# Altium schematic sheet HF.SchDoc: {Наименование}
size 420 x 297 mm; ApprovedBy: {Утвердил}; CheckedBy: {Проверил}; DrawnBy: {Разраб.}; DocumentNumber: АБВГ 123456.789 00; SheetNumber: {}; SheetTotal: {}; Scale: {Мш.}; PageSetup: Record=PageOptions|CenterHorizontal=False|CenterVertical=False|PrintScale=0.95|XCorrection=0.00|YCorrection=0.00|PrintKind=1|BorderSize=5000000|LeftOffset=0|BottomOffset=0|Orientation=1|PaperLength=1000|PaperWidth=1000|Scale=100|PaperSource=15|PrintQuality=600|MediaType=1|DitherType=10|PaperKind=A4|PrintScaleMode=1; ProcessInspection: {Т.контр.}; Mass: {М.}; NormInspection: {Н.контр.}; Letter1Column: {}; Letter2Column: {}; Letter3Column: {}; DocumentType: {Документ}; Rule: PcbType=ProtelPcb
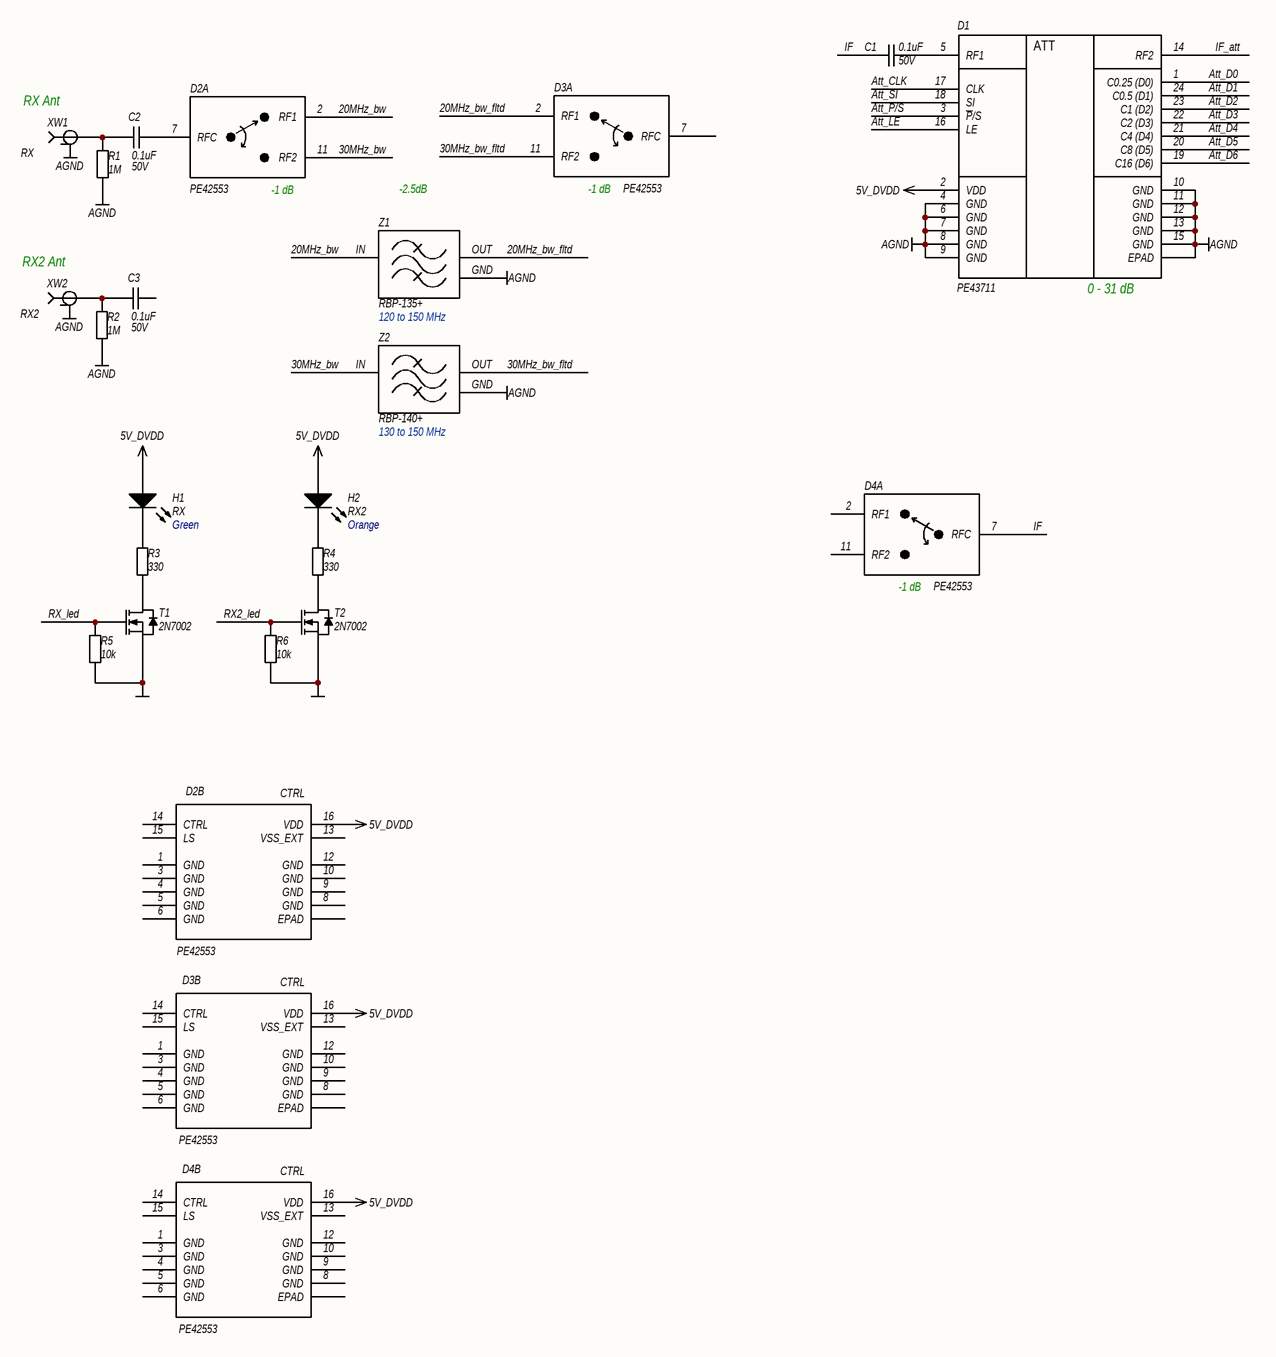
[diagram p0: HF.SchDoc]

## Parts
C1  value 0.1uF  Voltage: 50V  [C0402]  (hidden comment: CAP)
C2  value 0.1uF  Voltage: 50V  [C0402]  (hidden comment: CAP)
C3  value 0.1uF  Voltage: 50V  [C0402]  (hidden comment: CAP)
D1  PE43711  [QFN-24]
D2  PE42553  [QFN-16]  (parts A,B of 2)
D3  PE42553  [QFN-16]  (parts A,B of 2)
D4  PE42553  [QFN-16]  (parts A,B of 2)
H1  RX  Color: Green  [LED]
H2  RX2  Color: Orange  [LED]
R1  value 1M  [R0402]  (hidden comment: RES)
R2  value 1M  [R0402]  (hidden comment: RES)
R3  value 330  [R0805]  (hidden comment: RES)
R4  value 330  [R0805]  (hidden comment: RES)
R5  value 10k  [R0402]  (hidden comment: RES)
R6  value 10k  [R0402]  (hidden comment: RES)
T1  2N7002  [SOT-23]
T2  2N7002  [SOT-23]
XW1  RX  [MOLEX SD-73251-135 (Gold)]
XW2  RX2  [MOLEX SD-73251-135 (Gold)]
Z1  RBP-135+  Frequency: 120 to 150 MHz  [GP731]
Z2  RBP-140+  Frequency: 130 to 150 MHz  [GP731]

## Nets
5V_DVDD: D1.2(VDD) D2.16(VDD) D3.16(VDD) D4.16(VDD) H1.2(A) H2.2(A)
AGND: D1.4(GND) D1.6(GND) D1.7(GND) D1.8(GND) D1.9(GND) D1.10(GND) D1.11(GND) D1.12(GND) D1.13(GND) D1.15(GND) D1.25(EPAD) R1.2 R2.2 XW1.G(GND) XW2.G(GND) Z1.GND Z2.GND
GND: R5.2 R6.2 T1.2(S) T2.2(S)
20MHz_bw: D2.2(RF1) Z1.IN
20MHz_bw_fltd: D3.2(RF1) Z1.OUT
30MHz_bw: D2.11(RF2) Z2.IN
30MHz_bw_fltd: D3.11(RF2) Z2.OUT
Att_CLK: D1.17(CLK)
Att_D0: D1.1(C0.25_(D0))
Att_D1: D1.24(C0.5_(D1))
Att_D2: D1.23(C1_(D2))
Att_D3: D1.22(C2_(D3))
Att_D4: D1.21(C4_(D4))
Att_D5: D1.20(C8_(D5))
Att_D6: D1.19(C16_(D6))
Att_LE: D1.16(LE)
Att_P/~{S}: D1.3(~{P}/S)
Att_SI: D1.18(SI)
IF: C1.1 D4.7(RFC)
IF_att: D1.14(RF2)
RX2_led: R6.1 T2.1(G)
RX_led: R5.1 T1.1(G)
NetC1_2: C1.2 D1.5(RF1)
NetC2_1: C2.1 R1.1 XW1.S(RF)
NetC2_2: C2.2 D2.7(RFC)
NetC3_1: C3.1 R2.1 XW2.S(RF)
NetH1_1: H1.1(K) R3.1
NetH2_1: H2.1(K) R4.1
NetR3_2: R3.2 T1.3(D)
NetR4_2: R4.2 T2.3(D)

Not connected (* = marked no-connect by the designer): C3 2; D2 1(GND) 3(GND) 4(GND) 5(GND) 6(GND) 8(GND) 9(GND) 10(GND) 12(GND) 13(VSS_EXT) 14(CTRL) 15(LS) 17(EPAD); D3 1(GND) 3(GND) 4(GND) 5(GND) 6(GND) 7(RFC) 8(GND) 9(GND) 10(GND) 12(GND) 13(VSS_EXT) 14(CTRL) 15(LS) 17(EPAD); D4 1(GND) 2(RF1) 3(GND) 4(GND) 5(GND) 6(GND) 8(GND) 9(GND) 10(GND) 11(RF2) 12(GND) 13(VSS_EXT) 14(CTRL) 15(LS) 17(EPAD)

## Notes on the sheet
- (near XW1) RX Ant
- -2.5dB
- (near XW2) RX2 Ant
- Перв. примен.
- Справ. №
- Подп. и дата
- Инв. № дубл.
- Взам. инв. №
- Изм.
- Лист
- № докум.
- Подп.
- Дата
- Т.контр.
- Пров.
- Разраб.
- Лит.
- Листов
- Инв. № подл.
- Н.контр.
- Утв.
- Копировал
- Формат А3
- (in symbol PE42553, part A) -1 dB
- (in symbol PE43711) ATT; 0 - 31 dB

## Library data of the parts
C1-C3 = CAP: SMD Capacitor; Manufacturer: Murata; Material: X7R; Tolerance: 10%; Type: Ceramic Capacitor; P/N: GRM155R71H104KE14J
D1 = PE43711: The PE43711 is a 50Ω, HaRP™ technology-enhanced, 7-bit RF digital step attenuator; Manufacturer: Peregrine Technical Solutions; P/N: PE43711A-Z; Type: 7-bit RF digital step attenuator (DSA); Name: PE43711; Package: 24-lead 4 × 4 × 0.85 mm QFN; Supplier 1: Digi-Key; Supplier Part Number 1: 1046-1138-1-ND
D2-D4 = PE42553: HaRPTM technology-enhanced absorptive SPDT; Manufacturer: Peregrine Technical Solutions; P/N: PE42553A-Z; Type: SPDT RF Switch; Name: PE42553; Package: 16-lead 3 × 3 mm QFN; Supplier 1: Digi-Key; Supplier Part Number 1: 1046-1137-1-ND
H1 = LED: CHIP LED LAMP; Manufacturer: Kingbright; Name: APHCM2012; P/N: APHCM2012CGCK-F01; Package: 2.0 x 1.25 mm SMD; Type: CHIP LED LAMP; Supplier 1: Digi-Key; Supplier Part Number 1: 754-1094-1-ND
H2 = LED: CHIP LED LAMP; Manufacturer: Kingbright; Name: APHCM2012; P/N: APHCM2012SECK-F01; Package: 2.0 x 1.25 mm SMD; Type: CHIP LED LAMP
R1 R2 = RES: SMD Resistor; Name: Chip SMD Resistor; Power: 0.1 Wt; Tolerance: 5%; P/N: ERJ-2GEJ105X; Temperature Range: -55…155°C
R3 R4 = RES: SMD Resistor; Name: Chip SMD Resistor; Power: 0.125 Wt; Tolerance: 5%; P/N: ERJ-6GEYJ331V; Temperature Range: -55…155°C
R5 R6 = RES: SMD Resistor; Name: Chip SMD Resistor; Power: 0.1 Wt; Tolerance: 5%; P/N: ERJ-2GEJ103X; Temperature Range: -55…155°C
T1 T2 = 2N7002: N-Channel MOSFET 2N7002; Channel Resistance: 5Ohm; Current: 300mA; Power Dissipation: 0.83W; Voltage: 60V; Name: 2N7002; Type: SOT-23; Package: SOT-23
XW1 XW2 = RF Connector: 50 Ohms, SMA Jack, Vertica; Manufacturer: Molex; Impedance: 50Ω; P/N: 0732511352; Name: SMA Jack; Type: 50 Ohms, SMA Jack, Vertical, PCB SMT, Gold (Au) Body; Supplier 1: Digi-Key; Supplier Part Number 1: WM9458-ND
Z1 = RBP-135+: Bandpass Filter; Manufacturer: Mini-Circuits; Name: RBP-135+; P/N: RBP-135+; Type: Bandpass Filter; Package: GP731
Z2 = RBP-140+: Bandpass Filter; Manufacturer: Mini-Circuits; Name: RBP-140+; P/N: RBP-140+; Type: Bandpass Filter; Package: GP731